# Altium schematic sheet SCH_Sensor-Rudder_Altium.schdoc
size 208 x 175 mm
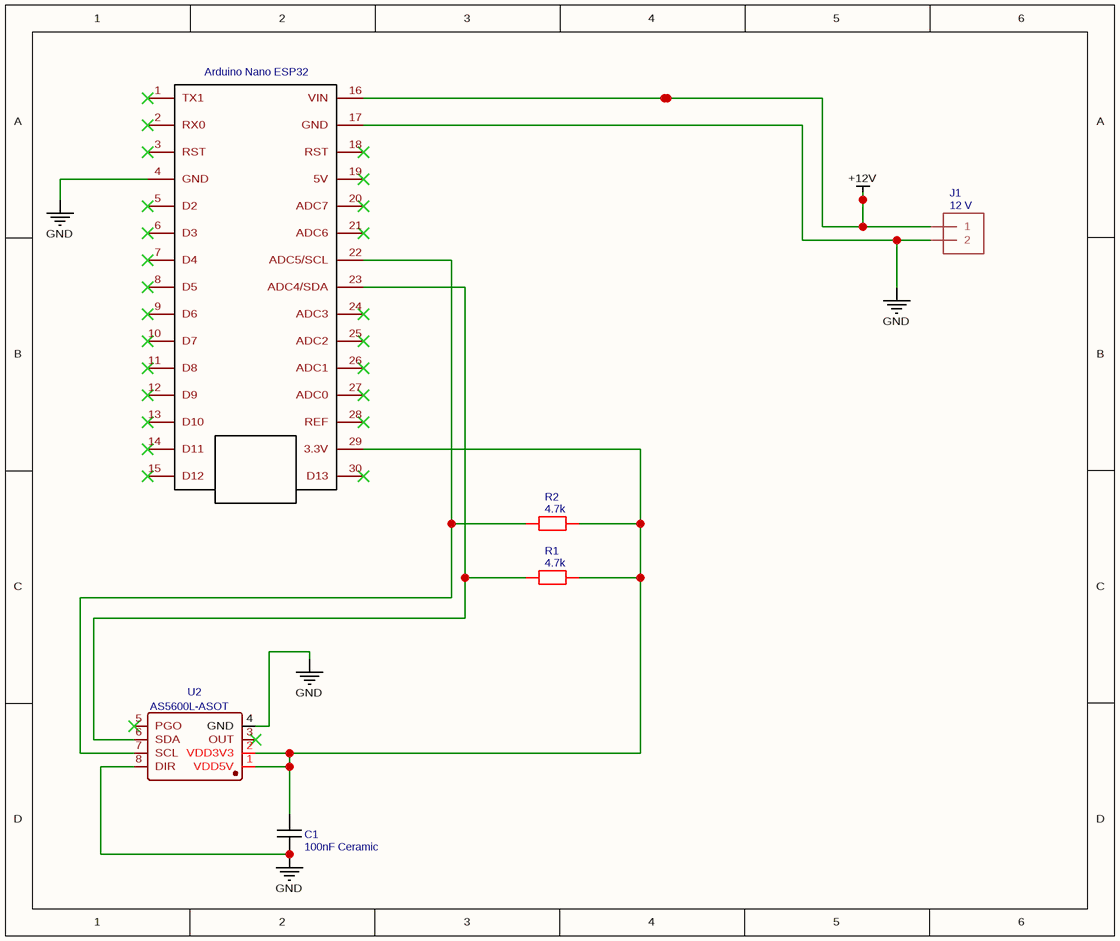
[diagram p0: SCH_Sensor-Rudder_Altium.schdoc]

## Parts
C1  100nF Ceramic  [CERAMIC CAPACITOR]
J1  12 V  [1X2-3.5MM]
R1  4.7k  [1K 0.25W]
R2  4.7k  [1K 0.25W]
U1  Arduino Nano ESP32  [ADUINO NANO R3]
U2  AS5600L-ASOT  [SOIC-8_L5.0-W4.0-P1.27-LS6.0-BL]

## Nets
+12V: J1.1 U1.16(VIN)
GND: C1.2 J1.2 U1.4(GND) U1.17(GND) U2.4(GND) U2.8(DIR)
NetC1_1: C1.1 R1.2 R2.2 U1.29(3.3V) U2.1(VDD5V) U2.2(VDD3V3)
NetR1_1: R1.1 U1.23(ADC4/SDA) U2.6(SDA)
NetR2_1: R2.1 U1.22(ADC5/SCL) U2.7(SCL)

Not connected (* = marked no-connect by the designer): U1 1(TX1)* 2(RX0)* 3(RST)* 5(D2)* 6(D3)* 7(D4)* 8(D5)* 9(D6)* 10(D7)* 11(D8)* 12(D9)* 13(D10)* 14(D11)* 15(D12)* 18(RST)* 19(5V)* 20(ADC7)* 21(ADC6)* 24(ADC3)* 25(ADC2)* 26(ADC1)* 27(ADC0)* 28(REF)* 30(D13)*; U2 3(OUT)* 5(PGO)*

## Library data of the parts
C1 = 100nF Ceramic: Manufacturer Part: Capacitor_Ceramic; Contributor: huuvinhz755; spicePre: C; spiceSymbolName: Capacitor_Ceramic
J1 = 12 V: Contributor: Adafruit; spicePre: J; spiceSymbolName: TERMBLOCK_1X2-3.5MM
R1 R2 = 4.7k: Contributor: Kagutsuchi; spicePre: R; spiceSymbolName: 1w resistor
U1 = Arduino Nano ESP32: Contributor: Nikolay Yanev; spicePre: U; spiceSymbolName: ARDUINO_NANO_R3
U2 = AS5600L-ASOT: Manufacturer: 美国AMS; Contributor: mromanini; Supplier: LCSC; Supplier Part: C499458; Manufacturer Part: AS5600L-ASOT; spicePre: U; spiceSymbolName: AS5600L-ASOM